# EAGLE design TailDisk (EAGLE 9.6.2)
CNAME: BotaLab; CREVISION: 1.0; DESIGNER: botamochi6277
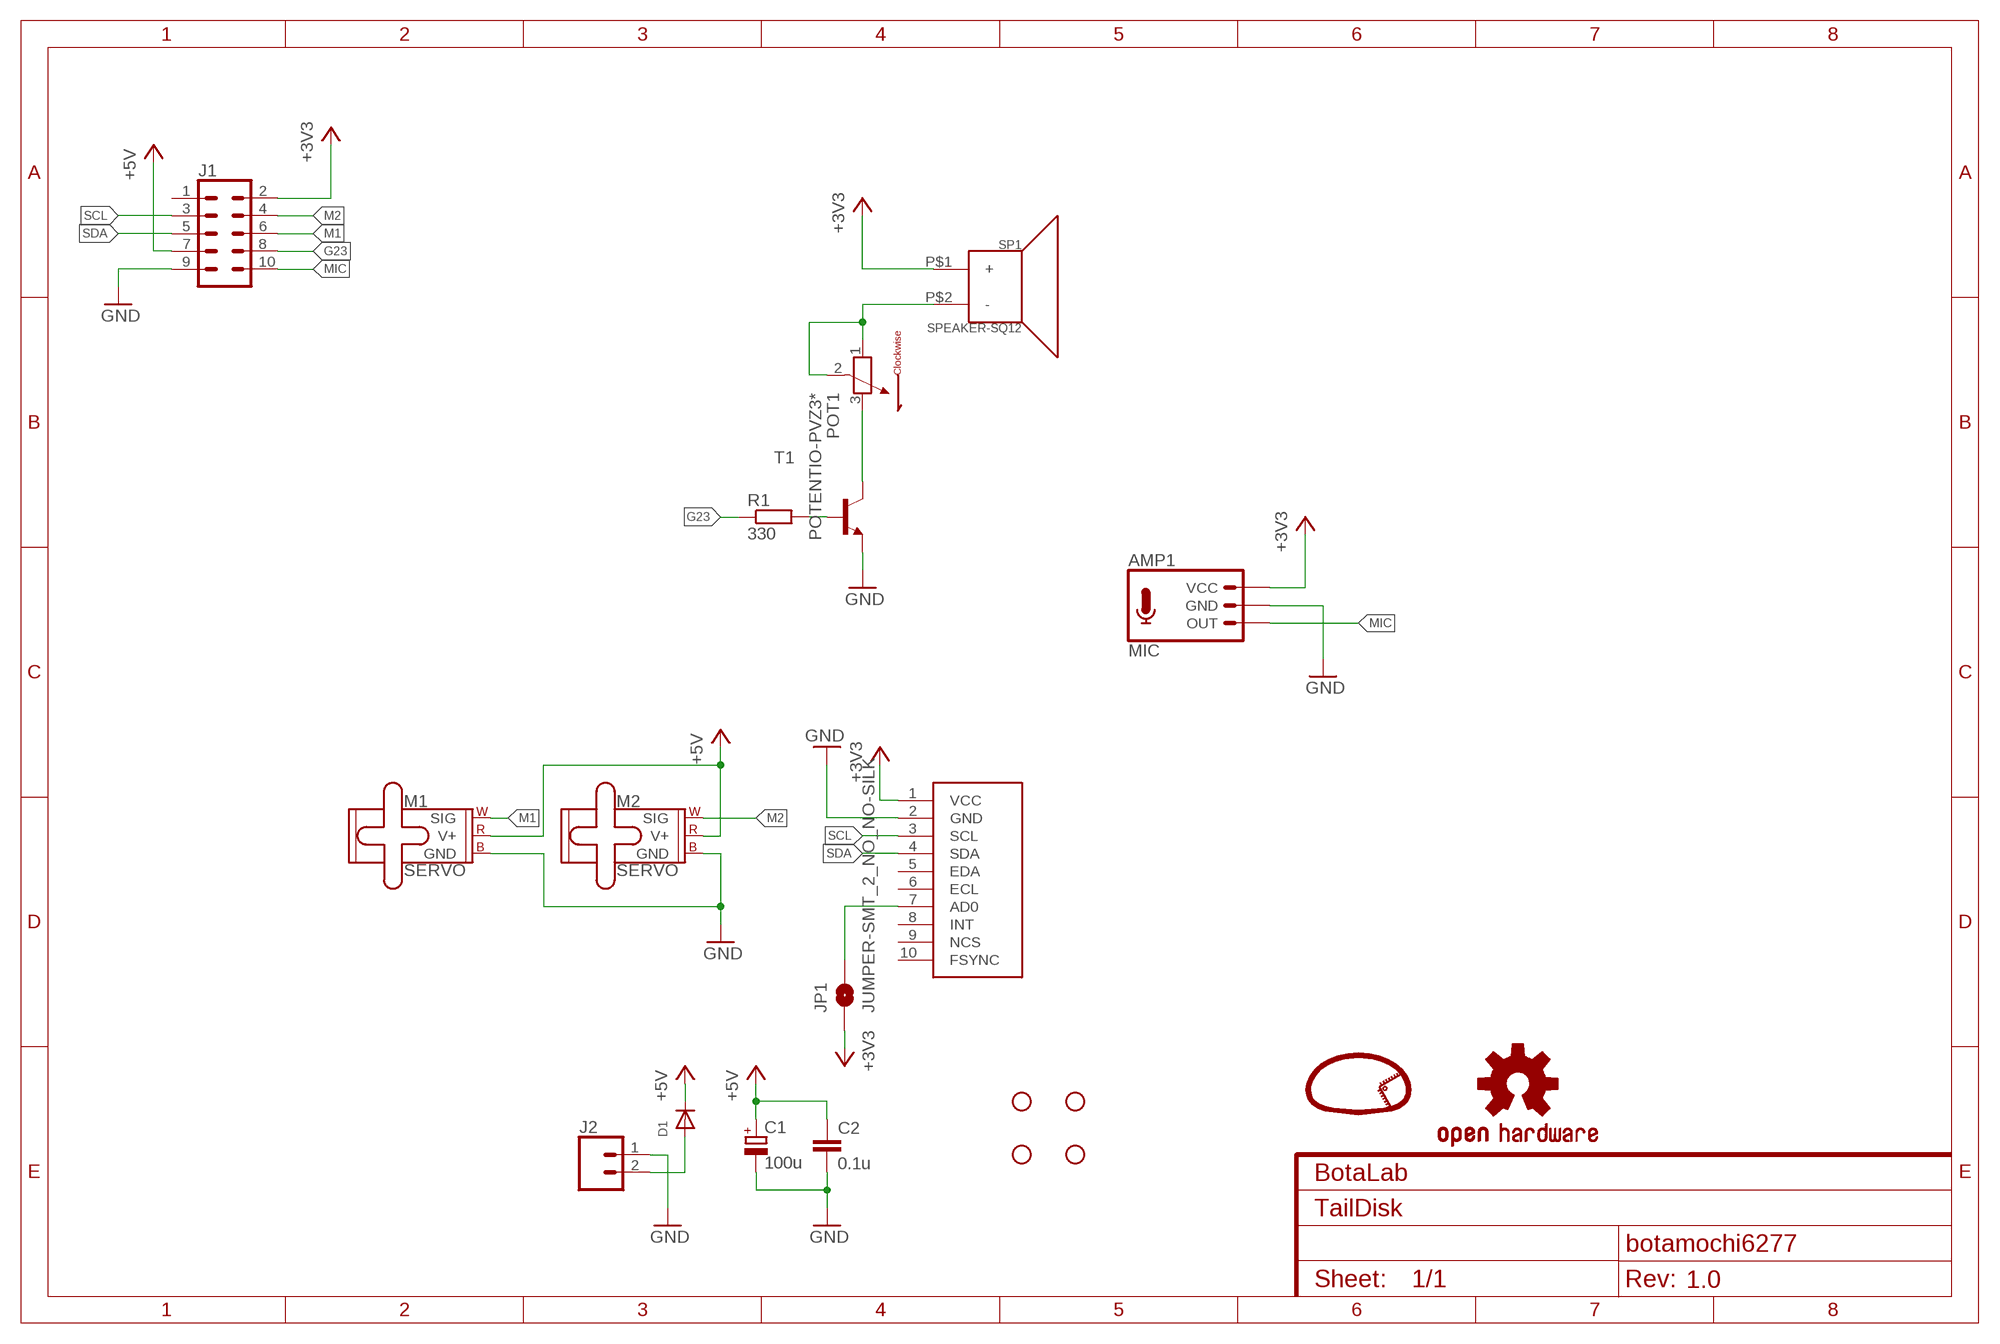
[diagram p0: schematic, sheet 1]

## Parts
AMP1  MIC  [ADAFRUIT-1063]
C1  100u  CPOL-EU153CLV-0605  [153CLV-0605]
C2  0.1u  C-EUC1608  [C1608]
D1  DIODE_SOD-123FL  [SOD-123FL]
H1  STAND-OFF3.3  [STAND-OFF-3.3]
H2  STAND-OFF3.3  [STAND-OFF-3.3]
H3  STAND-OFF3.3  [STAND-OFF-3.3]
H4  STAND-OFF3.3  [STAND-OFF-3.3]
IC1  IMU-MODULE  [IMU-MODULE]
J1  CONN_05X2RA  [2X5-RA]
J2  CONN_02-JST-2MM-SMT  [JST-2-SMD]
JP1  JUMPER-SMT_2_NO_NO-SILK  [SMT-JUMPER_2_NO_NO-SILK]
LOGO1  LOGO  [LOGO]
LOGO2  OSHW-LOGOS  [OSHW-LOGO-S]
M1  SERVO  [1X03]
M2  SERVO  [1X03]
POT1  POTENTIO-PVZ3*  [PVZ3*]
R1  330  R-EU_R0603  [R0603]
SP1  SPEAKER-SQ12  [PKLCS1212E]
T1  MMUN2211LT1-NPN-SC59-BEC  [SC59-BEC]

## Nets
+3V3 [pwr]: AMP1.P$3(VCC) IC1.1(VCC) J1.2 JP1.1 SP1.P$1(+)
+5V [pwr]: C1.+ C2.1 D1.C J1.7 M1.2(V+) M2.2(V+)
G23: J1.8 R1.1
GND [pwr]: AMP1.P$2(GND) C1.- C2.2 IC1.2(GND) J1.9 J2.1 M1.3(GND) M2.3(GND) T1.E
M1: J1.6 M1.1(SIG)
M2: J1.4 M2.1(SIG)
MIC: AMP1.P$1(OUT) J1.10
N$1: IC1.7(AD0) JP1.2
N$2: POT1.1 POT1.2 SP1.P$2(-)
N$3: POT1.3 T1.C
N$4: R1.2 T1.B
N$5 [pwr]: D1.A J2.2
SCL: IC1.3(SCL) J1.3
SDA: IC1.4(SDA) J1.5
Unconnected: IC1.5(EDA) IC1.6(ECL) IC1.8(INT) IC1.9(NCS) IC1.10(FSYNC) J1.1

## Library data of the parts
AMP1 = K-05757:MIC
C1 = rcl:CPOL-EU: POLARIZED CAPACITOR, European symbol; SPICEPREFIX: C
C2 = rcl:C-EU: CAPACITOR, European symbol; SPICEPREFIX: C
D1 = adafruit:DIODE: Diode SMADIODE - SMA Surface Mount Package 20V 1A Schottky Diode Digikey: 641-1014-6-ND DO-1N4148 - Through Hole Small Current Diode SOD-123 20V 1 A (.5mV Vf) Schottky Diode - Digikey: MBRX120TPMSCT-ND SOD-323 10V 570mA (.38mV Vf, 3ns) Schottky Diode - Digikey: ZLLS410CT-ND SOD-523 30V 30mA Schottky Diode (RB751S-40TE61) - Digikey: RB751S-40TE61CT-ND SOT23-R/W - SOT23 Package (R = Solder Paste/Reflow Ovens, W = Hand-Soldering) BAT54Film 40V 300mA - Digikey: 497-7162-1-ND
H1-H4 = Botamochi-sensors:STAND-OFF: Stand Off Drill holes for mechanically mounting via screws, standoffs, etc. Note: Use the keepout ring to avoid running the screw head into surrounding components. Variant Overviews STAND-OFF - Mechanical footprint for a #4 phillips button head screw. STAND-OFF-TIGHT - Mechanical footprint for a #4 phillips button head screw, Example SparkFun Products Screw - Phillips Head (1/4", 4-40, 10 pack) <https://www.sparkfun.com/products/10453> (PRT-10453) Screw - Phillips Head (1/2", 4-40, 10 pack) <https://www.sparkfun.com/products/10452> (PRT-10452) Screw - Phillips Head (3/4", 4-40, 10 pack) <https://www.sparkfun.com/products/10451> (PRT-10451) Screw - Phillips Head (1", 4-40, 10 pack) <https://www.sparkfun.com/products/10450> (PRT-10450)
IC1 = HiLetgo-IMU-Module:IMU-MODULE: HiLetgo MPU9250 / 6500 <https://www.amazon.co.jp/dp/B0154PM102> Module
J1 = SparkFun-Connectors:CONN_05X2: Multi connection point. Often used as Generic Header-pin footprint for 0.1 inch spaced/style header connections For AVR SPI programming port, see special device with nice symbol: "AVR_SPI_PROG_5x2.dev" You can populate with any combo of single row headers, but if you'd like an exact match, check these: 2x5 AVR ICSP Male Header <https://www.sparkfun.com/products/778> (PRT-00778) 2x5 Pin Shrouded Header <https://www.sparkfun.com/products/8506> (PRT-08506) On any of the 0.1 inch spaced packages, you can populate with these: Break Away Headers - Straight <https://www.sparkfun.com/products/116> (PRT-00116) Break Away Male Headers - Right Angle <https://www.sparkfun.com/products/553> (PRT-00553) Female Headers <https://www.sparkfun.com/products/115> (PRT-00115) Break Away Headers - Machine Pin <https://www.sparkfun.com/products/117> (PRT-00117) Break Away Female Headers - Swiss Machine Pin <https://www.sparkfun.com/products/743> (PRT-00743) Special note: the shrouded connector mates well with our 5x2 ribbon cables: 2x5 Pin IDC Ribbon Cable <https://www.sparkfun.com/products/8535> (PRT-08535)
J2 = SparkFun-Connectors:CONN_02: Multi connection point. Often used as Generic Header-pin footprint for 0.1 inch spaced/style header connections On any of the 0.1 inch spaced packages, you can populate with these: Break Away Headers - Straight <https://www.sparkfun.com/products/116> (PRT-00116) Break Away Male Headers - Right Angle <https://www.sparkfun.com/products/553> (PRT-00553) Female Headers <https://www.sparkfun.com/products/115> (PRT-00115) Break Away Headers - Machine Pin <https://www.sparkfun.com/products/117> (PRT-00117) Break Away Female Headers - Swiss Machine Pin <https://www.sparkfun.com/products/743> (PRT-00743) For SCREWTERMINALS and SPRING TERMINALS visit here: Screw Terimnals on SparkFun.com <https://www.sparkfun.com/search/results?term=Screw+Terminals> (5mm/3.5mm/2.54mm spacing) This device is also useful as a general connection point to wire up your design to another part of your project. Our various solder wires solder well into these plated through hole pads. Hook-Up Wire - Assortment (Stranded, 22 AWG) <https://www.sparkfun.com/products/11375> (PRT-11375) Hook-Up Wire - Assortment (Solid Core, 22 AWG) <https://www.sparkfun.com/products/11367> (PRT-11367) View the entire wire category on our website here <https://www.sparkfun.com/categories/141> Special notes: Molex polarized connector foot print use with: PRT-08233 with associated crimp pins and housings. 2.54_SCREWTERM for use with PRT-10571. 3.5mm Screw Terminal footprints for PRT-08084 5mm Screw Terminal footprints for use with PRT-08432; PROD_ID: CONN-11443
JP1 = SparkFun-Jumpers:JUMPER-SMT_2_NO: Normally open jumper This jumper has two pads in close proximity to each other. Apply solder to close the connection. Round pads are easier to solder for beginners, but are a lot larger. SparkFun Product that uses the round pads: SparkFun EL Sequencer <https://www.sparkfun.com/products/12781>
LOGO1 = botamochi-symbol:LOGO
LOGO2 = SparkFun-Aesthetics:OSHW-LOGO: Open-Source Hardware (OSHW) Logo This logo indicates the piece of hardware it is found on incorporates a OSHW license and/or adheres to the definition of open source hardware found here: http://freedomdefined.org/OSHW
M1 M2 = SparkFun-Electromechanical:SERVO: Servo Motor 3-pin connector for a standard servo motor (voltage supply, ground, and control signal.) SparkFun Products Servo - Generic (Sub-Micro Size) <https://www.sparkfun.com/products/9065> (ROB-09065) Servo - Generic High Torque Continuous Rotation (Standard Size) <https://www.sparkfun.com/products/9347> (ROB-09347) Servo - Generic High Torque (Standard Size) <https://www.sparkfun.com/products/11965> (ROB-11965)
POT1 = Botamochi-Potentiometer:POTENTIO
R1 = rcl:R-EU_: RESISTOR, European symbol; SPICEPREFIX: R
SP1 = Botamochi-Speaker:SPEAKER
T1 = transistor:*-NPN-: NPN Transistror BF959 corrected 2008.03.06

## Net classes
0 default: width 0.5 mm
1 pwr: width 1 mm, clearance 0.5 mm

## Board
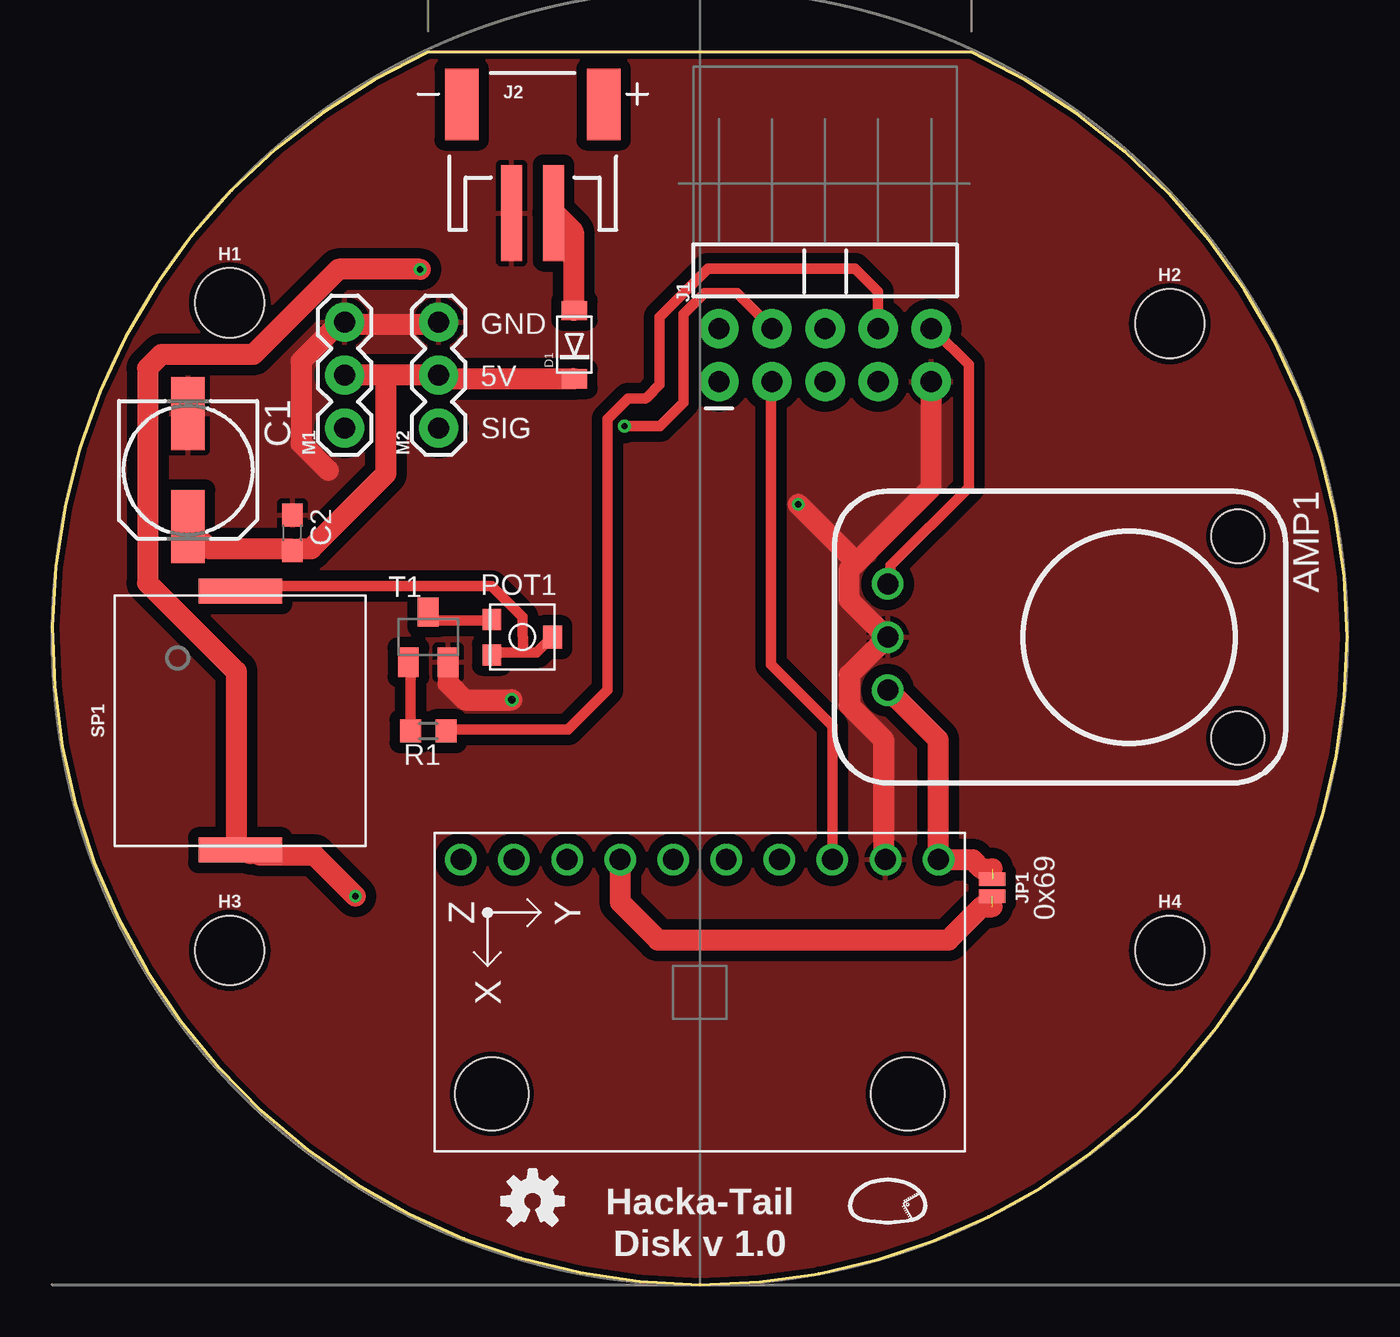
[diagram p1: board, top side]
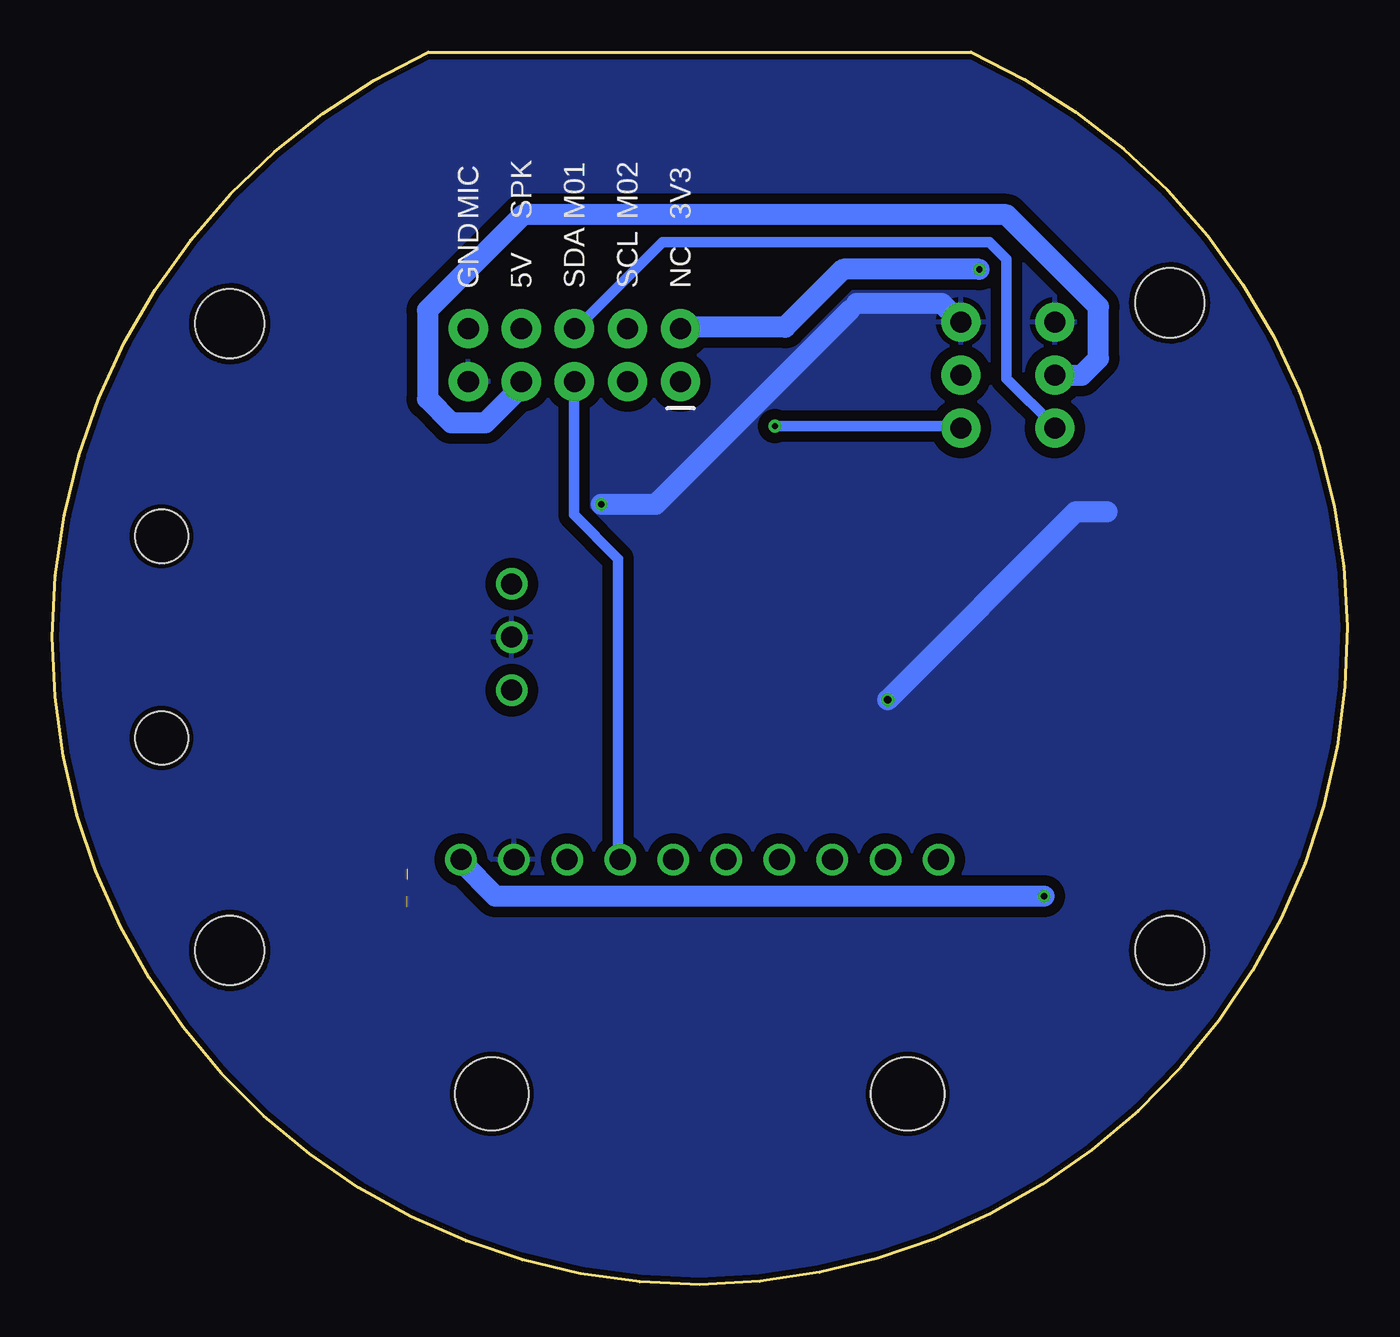
[diagram p2: board, bottom side, seen from below]

Size 62 x 59 mm. Coordinates in mm from the lower left corner, seen from the top.
Outline: 44,59 18,59 arc65 0,31.5 arc90 31,0 arc90 62,31 arc65 44,59
Copper layers (1*16): Top 0.035mm / dielectric 1.5mm / Bottom 0.035mm
Design rules "ssci_SeeedStudio_2layer_DRU_no_angle *": minimum track width 0.5mm, minimum drill 12mil, track to track 6mil, track to pad 6mil, pad to pad 6mil, via to via 6mil, smd to smd 0mil, copper to edge 10mil, drill to drill 10mil, minimum pad ring 10mil, minimum via ring 6mil, stop-mask expansion 2mil, vias tented up to drill 25mil, thermal gap 10mil

### Footprints (pad centres in the part's own frame; a part is rotated, then mirrored left to right if it is on the bottom)
ADAFRUIT-1063 = drill 1: P$1 -2.54,0; P$2 0,0; P$3 2.54,0 | hole 2.54: -4.826,16.764; 4.826,16.764
153CLV-0605 = smd 3.5 x 1.6: + 2.7,0; - -2.7,0
C1608 = smd 1.1 x 1: 1 -0.85,0; 2 0.85,0
SOD-123FL = smd 0.91 x 1.22: A 1.637,0; C -1.637,0
STAND-OFF-3.3 = hole 3.302: 0,0
IMU-MODULE = drill 1: 1 -6.35,11.43; 2 -6.35,8.89; 3 -6.35,6.35; 4 -6.35,3.81; 5 -6.35,1.27; 6 -6.35,-1.27; 7 -6.35,-3.81; 8 -6.35,-6.35; 9 -6.35,-8.89; 10 -6.35,-11.43 | hole 3.5: 4.87,9.95; 4.87,-9.95
2X5-RA = drill 1.016 pad 1.88: 1 -1.27,5.08; 2 1.27,5.08; 3 -1.27,2.54; 4 1.27,2.54; 5 -1.27,0; 6 1.27,0; 7 -1.27,-2.54; 8 1.27,-2.54; 9 -1.27,-5.08; 10 1.27,-5.08
JST-2-SMD = smd 1 x 4.6: 1 -1,-3.7; 2 1,-3.7 | smd 1.6 x 3.4: NC1 -3.4,1.5; NC2 3.4,1.5
SMT-JUMPER_2_NO_NO-SILK = smd 0.635 x 1.27: 1 -0.406,0; 2 0.406,0
1X03 = drill 1.016 pad 1.88: 1 0,0; 2 2.54,0; 3 5.08,0
PVZ3* = smd 1 x 0.9: 1 0.85,-1.45; 3 -0.85,-1.45 | smd 1.1 x 0.9: 2 0,1.45
R0603 = smd 1 x 1.1: 1 -0.85,0; 2 0.85,0
PKLCS1212E = smd 1.2 x 4: P$1 -6.2,0; P$2 6.2,0
SC59-BEC = smd 1 x 1.4: B -0.95,-1.2; C 0,1.2; E 0.95,-1.2

### Placement (x,y rotation side)
AMP1  40,31 270 top
C1  6.5,39 270 top
C2  11.5,36 90 top
D1  25,45 90 top
H1  8.5,47 0 top
H2  53.5,46 0 top
H3  8.5,16 0 top
H4  53.5,16 0 top
IC1  31,14 270 top
J1  37,44.5 90 top
J2  23,55 0 top
JP1  45,19 270 top
LOGO1  40,4 0 top
LOGO2  23,4 0 top
M1  14,41 90 top
M2  18.5,41 90 top
POT1  22.5,31 270 top
R1  18,26.5 180 top
SP1  9,27 90 top
T1  18,31 0 top

### Tracks (layer width: path | path; a pad name or v marks a point on that pad's centre or on a via)
+3V3  (via drill 0.3)  (1 unrouted)
  Top 1: AMP1.P$3 40.12,28.38 42.41,26.1 42.41,20.39 IC1.1 44.06,20.35 44.49,19.91 45,19.91 | 8.99,20.95 SP1.P$1 | 9.48,20.63 SP1.P$1 | v14.52,18.59 12.56,20.55 9.95,20.55 SP1.P$1 | v17.61,48.6 13.7,48.6 9.62,44.53 5.22,44.53 4.57,43.87 4.57,33.6 8.81,29.36 8.81,21.37 SP1.P$1
  Bottom 1: v17.61,48.6 24.14,48.6 26.91,45.83 31.8,45.83 J1.2 | v14.52,18.59 40.77,18.59 42.41,20.22 IC1.1
+5V
  Top 1: 15.98,43.55 18.43,43.55 M2.2 18.92,43.38 24.95,43.38 D1.C | 15.98,43.55 14.03,43.55 M1.2 | C1.+ 6.52,36.21 7.5,35.23 11.42,35.23 C2.1 11.91,35.23 12.4,35.23 15.98,38.82 15.98,43.06 15.98,43.55
  Bottom 1: J1.7 39.63,43.22 39.63,42.9 41.26,41.26 42.9,41.26 44.04,42.41 44.04,46.65 39.47,51.21 16.31,51.21 11.91,46.81 11.91,44.34 12.71,43.54 M1.2
G23
  Top 0.5: 18.94,26.5 R1.1 19.08,26.59 24.7,26.59 26.59,28.47 26.59,41.43 27.56,42.41 28.38,42.41 28.5,42.5 29.08,43.08 29.08,46.31 31.4,48.64 38.44,48.64 39.54,47.53 J1.8
GND  (via drill 0.3, 0.35)
  Top 1: IC1.2 39.8,20.39 39.8,26.1 38.16,27.73 38.16,29.2 39.96,30.99 AMP1.P$2 39.63,31.32 38.16,32.78 38.16,34.25 38.49,34.58 | 38.49,34.58 42.08,38.16 J1.9 | 13.21,38.98 11.91,40.29 11.91,44.2 13.86,46.16 M1.3 14.52,45.99 18.43,45.99 M2.3 | v35.72,37.35 38.16,34.9 38.49,34.58 | v22,28 19.75,28 18.95,28.8 T1.E
  Bottom 1: 23.49,46.97 19.41,46.97 18.59,46.16 M2.3 | v35.72,37.35 33.11,37.35 23.81,46.65 | v22,28 13,37 11.5,37
  pour Top: -2,60 62,60 62,-3.5 -2,-3.5
  pour Bottom: -3,60 63.5,60 63.5,-2 -3,-2
M1
  Bottom 0.5: M1.1 14.03,41.1 16.31,43.38 16.31,49.09 17.12,49.91 32.78,49.91 36.86,45.83 J1.6
M2  (via drill 0.3)
  Top 0.5: 18.59,41.1 M2.1 | J1.4 34.41,45.83 32.78,47.46 31.22,47.46 30.23,46.47 30.23,42.23 29.1,41.1 28.87,41.1 v27.4,41.1
  Bottom 0.5: v27.4,41.1 18.59,41.1 M2.1
MIC
  Top 0.5: AMP1.P$1 40.12,33.6 40.12,34.41 43.87,38.16 43.87,44.04 42.24,45.67 J1.10
N$1  (1 unrouted)
  Top 1: IC1.7 27.19,18.31 29,16.5 42.91,16.5 44.49,18.09 45,18.09
N$2
  Top 0.5: 22.54,30.25 23.18,30.25 23.83,30.9 POT1.2 | 22.54,30.25 21.06,30.25 POT1.1 | 22.54,30.25 22.54,30.91 22.51,31.15 22.51,31.97 21.04,33.44 9.3,33.44 SP1.P$2 9.15,33.35
N$3
  Top 0.5: 18.29,31.88 18.12,32.05 T1.C 18.43,31.8 20.71,31.8 POT1.3 20.9,31.88
N$4
  Top 0.5: R1.2 17.15,26.66 17.15,29.76 T1.B
N$5
  Top 1: D1.A 24.95,46.65 24.95,50.4 24.14,51.21 J2.2
SCL
  Top 0.5: IC1.3 37.35,20.39 37.35,26.75 34.41,29.68 34.41,43.22 J1.3
SDA
  Bottom 0.5: IC1.4 34.9,20.39 34.9,34.74 37.02,36.86 37.02,43.22 J1.5

### Text on the board
tNames: GND | 5V | SIG | 0x69 | Hacka-Tail | Disk v 1.0
bNames: 3V3 | M02 | M01 | SPK | MIC | NC | SCL | SDA | 5V | GND